# EAGLE design Power Distribution Board (EAGLE 7.7.0)

## Sheet 1 of 6: Main
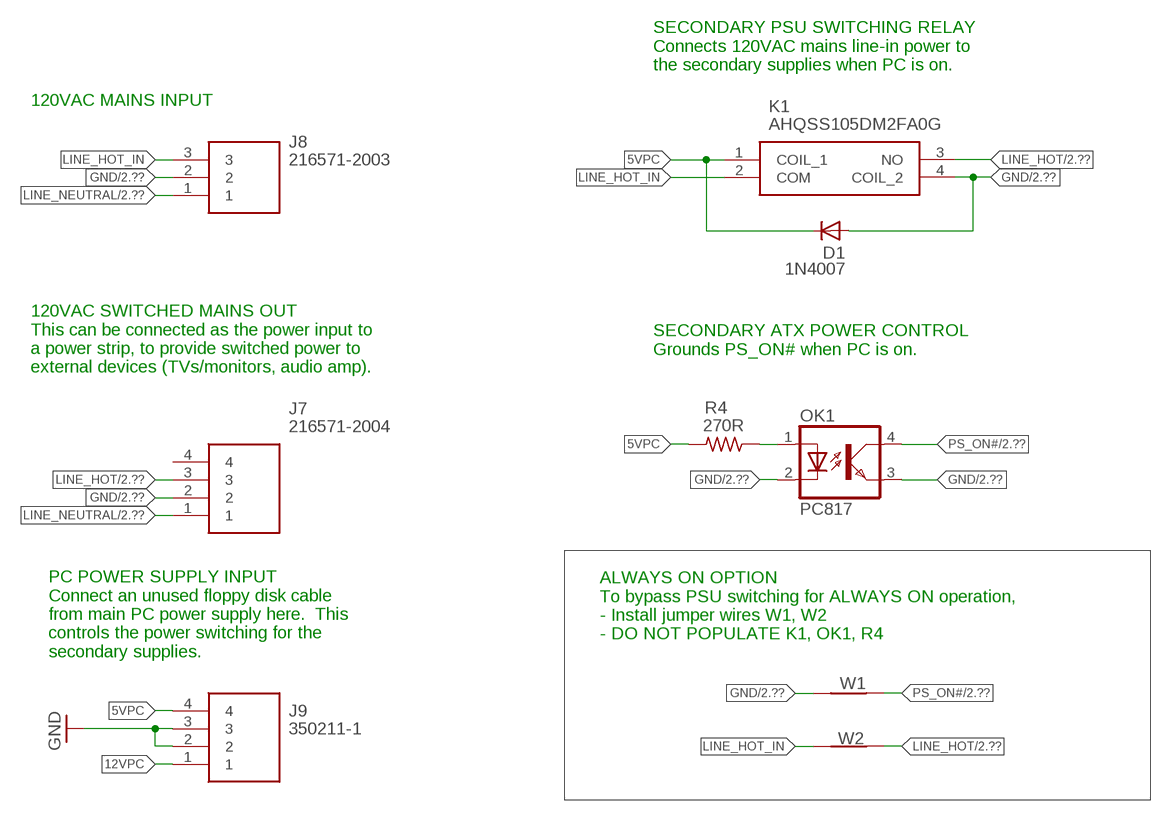
[diagram p0: schematic, sheet 1]

### Parts
D1  1N4007  [DO41-10]
J7  216571-2004  [216571-YY04_1]
J8  216571-2003  [216571-YY03_1]
J9  350211-1  [3502111]
K1  AHQSS105DM2FA0G  [AHQSS105DM2FA0G]
OK1  PC817  [DIL04]
R4  270R  R-US_0204/7  [0204/7]
W1  JUMPER-WIRE  [JUMPER-WIRE]
W2  JUMPER-WIRE  [JUMPER-WIRE]

### Nets
5VPC: D1.C J9.4 K1.1(COIL_1) R4.2
12VPC: J9.1
GND: D1.A J7.2 J8.2 J9.2 J9.3 K1.4(COIL_2) OK1.2(C) OK1.3(EMIT) W1.P$1 ; also sheet 2,3,4,5,6
LINE_HOT: J7.3 K1.3(NO) W2.P$2 ; also sheet 2,3,4
LINE_HOT_IN: J8.3 K1.2(COM) W2.P$1
LINE_NEUTRAL: J7.1 J8.1 ; also sheet 2,3,4
N$4: OK1.1(A) R4.1
PS_ON#: OK1.4(COL) W1.P$2 ; also sheet 2
Unconnected: J7.4

### Notes on the sheet
- SECONDARY PSU SWITCHING RELAY
  Connects 120VAC mains line-in power to
  the secondary supplies when PC is on.
- 120VAC MAINS INPUT
- SECONDARY ATX POWER CONTROL
  Grounds PS_ON# when PC is on.
- 120VAC SWITCHED MAINS OUT
  This can be connected as the power input to
  a power strip, to provide switched power to
  external devices (TVs/monitors, audio amp).
- ALWAYS ON OPTION
  To bypass PSU switching for ALWAYS ON operation,
  - Install jumper wires W1, W2
  - DO NOT POPULATE K1, OK1, R4
- PC POWER SUPPLY INPUT
  Connect an unused floppy disk cable
  from main PC power supply here.  This
  controls the power switching for the
  secondary supplies.

## Sheet 2 of 6: 5/12V SMPS/ATX
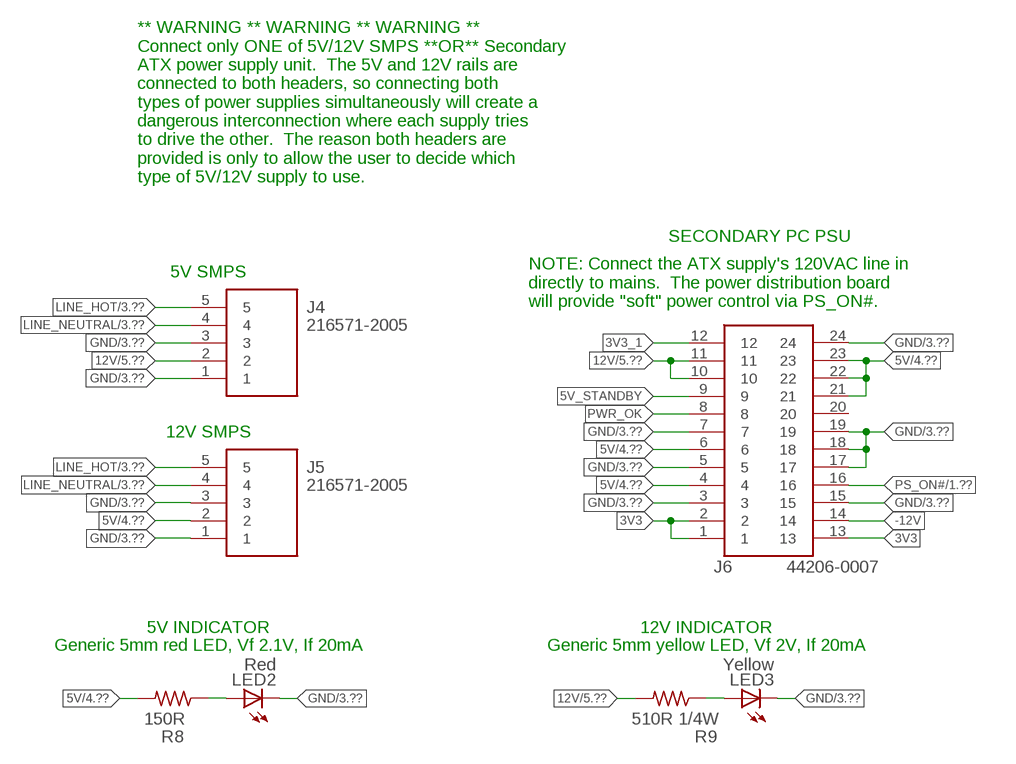
[diagram p1: schematic, sheet 2]

### Parts
J4  216571-2005  [216571-YY05_1]
J5  216571-2005  [216571-YY05_1]
J6  44206-0007  [44206-0007_1]
LED2  Red  LED5MM  [LED5MM]
LED3  Yellow  LED5MM  [LED5MM]
R8  150R  R-US_0309/12  [0309/12]
R9  510R 1/4W  R-US_0309/12  [0309/12]

### Nets
3V3: J6.1 J6.2 J6.13
3V3_1: J6.12
5V: J5.2 J6.4 J6.6 J6.21 J6.22 J6.23 R8.2 ; also sheet 4,5
5V_STANDBY: J6.9
12V: J4.2 J6.10 J6.11 R9.2 ; also sheet 5,6
-12V: J6.14
GND: J4.1 J4.3 J5.1 J5.3 J6.3 J6.5 J6.7 J6.15 J6.17 J6.18 J6.19 J6.24 LED2.K(C) LED3.K(C) ; also sheet 1,3,4,5,6
LINE_HOT: J4.5 J5.5 ; also sheet 1,3,4
LINE_NEUTRAL: J4.4 J5.4 ; also sheet 1,3,4
N$9: LED2.A R8.1
N$10: LED3.A R9.1
PS_ON#: J6.16 ; also sheet 1
PWR_OK: J6.8
Unconnected: J6.20

### Notes on the sheet
- ** WARNING ** WARNING ** WARNING **
  Connect only ONE of 5V/12V SMPS **OR** Secondary
  ATX power supply unit.  The 5V and 12V rails are
  connected to both headers, so connecting both
  types of power supplies simultaneously will create a
  dangerous interconnection where each supply tries
  to drive the other.  The reason both headers are
  provided is only to allow the user to decide which
  type of 5V/12V supply to use.
- SECONDARY PC PSU
- 5V SMPS
- NOTE: Connect the ATX supply's 120VAC line in
  directly to mains.  The power distribution board
  will provide "soft" power control via PS_ON#.
- 12V SMPS
- 5V INDICATOR | 12V INDICATOR
- Generic 5mm red LED, Vf 2.1V, If 20mA | Generic 5mm yellow LED, Vf 2V, If 20mA

## Sheet 3 of 6: 24V SMPS
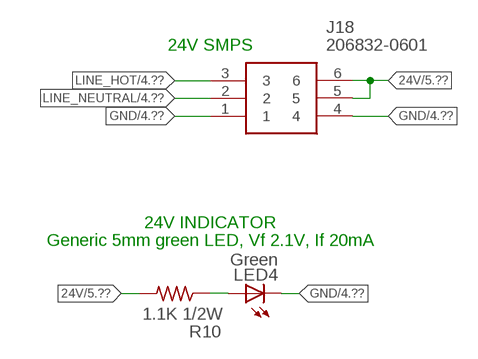
[diagram p2: schematic, sheet 3]

### Parts
J18  206832-0601  [2068320601]
LED4  Green  LED5MM  [LED5MM]
R10  1.1K 1/2W  R-US_0309/12  [0309/12]

### Nets
24V: J18.5 J18.6 R10.2 ; also sheet 5
GND: J18.1 J18.4 LED4.K(C) ; also sheet 1,2,4,5,6
LINE_HOT: J18.3 ; also sheet 1,2,4
LINE_NEUTRAL: J18.2 ; also sheet 1,2,4
N$11: LED4.A R10.1

### Notes on the sheet
- 24V SMPS
- 24V INDICATOR
- Generic 5mm green LED, Vf 2.1V, If 20mA

## Sheet 4 of 6: 48V SMPS
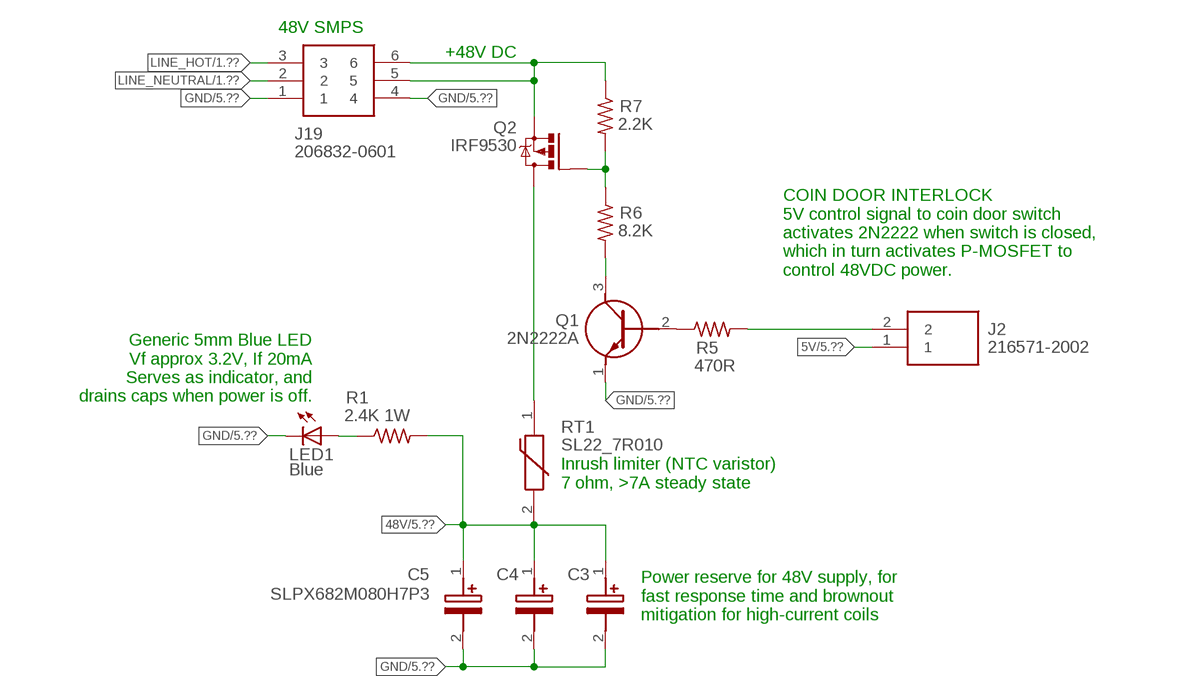
[diagram p3: schematic, sheet 4]

### Parts
C3  SLPX682M080H7P3  [CAPPRD1000W100D3550H4200]
C4  SLPX682M080H7P3  [CAPPRD1000W100D3550H4200]
C5  SLPX682M080H7P3  [CAPPRD1000W100D3550H4200]
J2  216571-2002  [216571-YY02_1]
J19  206832-0601  [2068320601]
LED1  Blue  LED5MM  [LED5MM]
Q1  2N2222A  [2N2222A]
Q2  IRF9530  [TO220BV]
R1  2.4K 1W  R-US_0309/12  [0309/12]
R5  470R  R-US_0204/7  [0204/7]
R6  8.2K  R-US_0207/10  [0207/10]
R7  2.2K  R-US_0207/10  [0207/10]
RT1  SL22_7R010  [SL227R010]

### Nets
5V: J2.1 ; also sheet 2,5
48V: C3.1(+) C4.1(+) C5.1(+) R1.2 RT1.2 ; also sheet 5
GND: C3.2(-) C4.2(-) C5.2(-) J19.1 J19.4 LED1.K(C) Q1.1(E) ; also sheet 1,2,3,5,6
LINE_HOT: J19.3 ; also sheet 1,2,3
LINE_NEUTRAL: J19.2 ; also sheet 1,2,3
N$1: J19.5 J19.6 Q2.S R7.1
N$2: Q2.D RT1.1
N$3: LED1.A R1.1
N$5: Q2.G R6.1 R7.2
N$6: Q1.3(C) R6.2
N$7: Q1.2(B) R5.1
N$8: J2.2 R5.2

### Notes on the sheet
- 48V SMPS
- +48V DC
- COIN DOOR INTERLOCK
  5V control signal to coin door switch
  activates 2N2222 when switch is closed,
  which in turn activates P-MOSFET to
  control 48VDC power.
- Generic 5mm Blue LED
  Vf approx 3.2V, If 20mA
  Serves as indicator, and
  drains caps when power is off.
- Inrush limiter (NTC varistor)
  7 ohm, >7A steady state
- Power reserve for 48V supply, for
  fast response time and brownout
  mitigation for high-current coils

## Sheet 5 of 6: Outputs
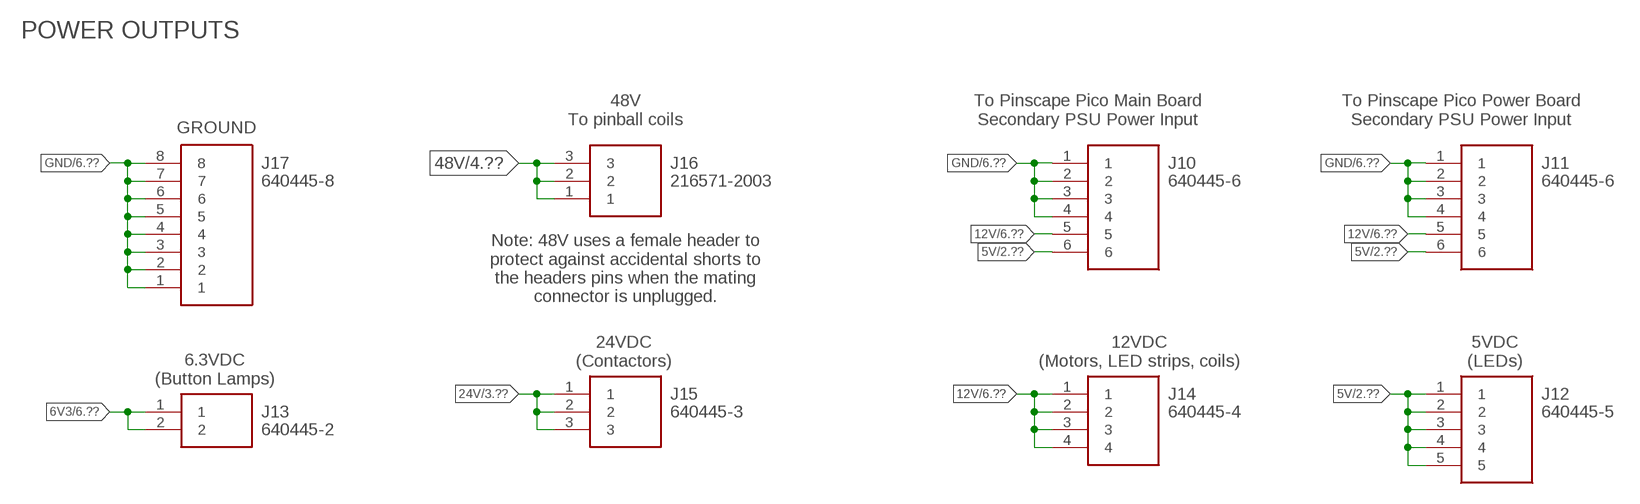
[diagram p4: schematic, sheet 5]

### Parts
J10  640445-6  [SHDR6W183P0X396_1X6_2377X762X1]
J11  640445-6  [SHDR6W183P0X396_1X6_2377X762X1]
J12  640445-5  [HDRV5W117P0X396_1X5_1981X762X1]
J13  640445-2  [SHDR2W117P0X396_1X2_792X762X11]
J14  640445-4  [SHDR4W117P0X396_1X4_1585X762X1]
J15  640445-3  [HDRV3W140P0X396_1X3_1189X762X1]
J16  216571-2003  [216571-YY03_1]
J17  640445-8  [SHDR8W117P0X396_1X8_3170X762X1]

### Nets
5V: J10.6 J11.6 J12.1 J12.2 J12.3 J12.4 J12.5 ; also sheet 2,4
6V3: J13.1 J13.2 ; also sheet 6
12V: J10.5 J11.5 J14.1 J14.2 J14.3 J14.4 ; also sheet 2,6
24V: J15.1 J15.2 J15.3 ; also sheet 3
48V: J16.1 J16.2 J16.3 ; also sheet 4
GND: J10.1 J10.2 J10.3 J10.4 J11.1 J11.2 J11.3 J11.4 J17.1 J17.2 J17.3 J17.4 J17.5 J17.6 J17.7 J17.8 ; also sheet 1,2,3,4,6

### Notes on the sheet
- POWER OUTPUTS
- 48V
  To pinball coils
- To Pinscape Pico Main Board
  Secondary PSU Power Input
- To Pinscape Pico Power Board
  Secondary PSU Power Input
- GROUND
- Note: 48V uses a female header to
  protect against accidental shorts to
  the headers pins when the mating
  connector is unplugged.
- 24VDC
  (Contactors)
- 12VDC
  (Motors, LED strips, coils)
- 5VDC
  (LEDs)
- 6.3VDC
  (Button Lamps)

## Sheet 6 of 6: 6.3V Lamp Power
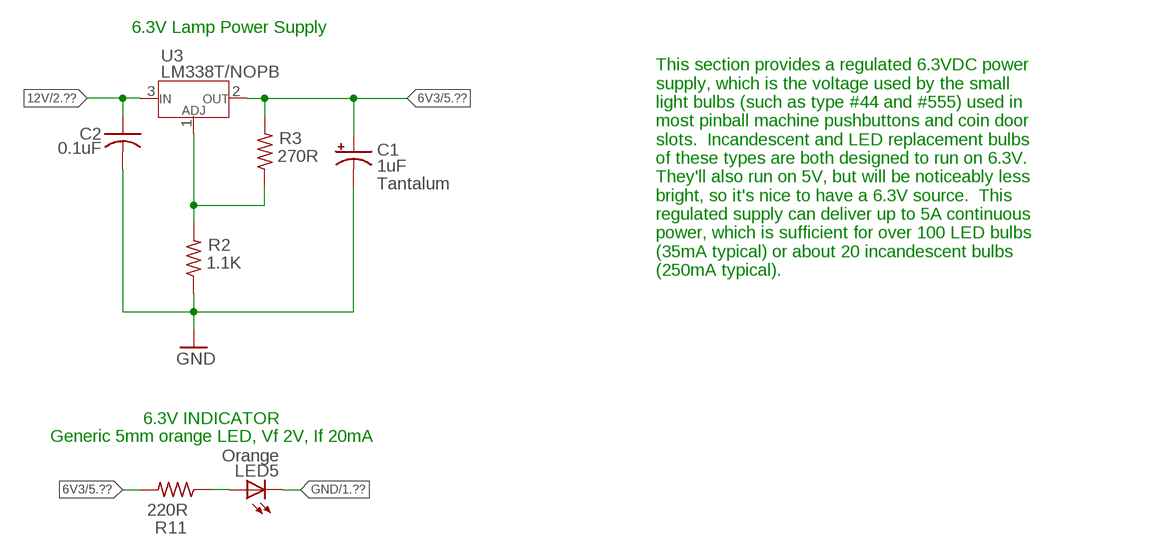
[diagram p5: schematic, sheet 6]

### Parts
C1  1uF  CPOL-US_TANTALUMB45181B  [B45181B]
C2  0.1uF  C-US025-030X050  [C025-030X050]
LED5  Orange  LED5MM  [LED5MM]
R2  1.1K  R-US_0204/7  [0204/7]
R3  270R  R-US_0204/7  [0204/7]
R11  220R  R-US_0309/12  [0309/12]
U3  LM338T/NOPB  [T03B_TEX]

### Nets
6V3: C1.+ R3.2 R11.2 U3.2(OUT) ; also sheet 5
12V: C2.1 U3.3(IN) ; also sheet 2,5
GND: C1.- C2.2 LED5.K(C) R2.1 ; also sheet 1,2,3,4,5
N$12: LED5.A R11.1
N$32: R2.2 R3.1 U3.1(ADJ)

### Notes on the sheet
- 6.3V Lamp Power Supply
- Tantalum
- This section provides a regulated 6.3VDC power
  supply, which is the voltage used by the small
  light bulbs (such as type #44 and #555) used in
  most pinball machine pushbuttons and coin door
  slots.  Incandescent and LED replacement bulbs
  of these types are both designed to run on 6.3V.
  They'll also run on 5V, but will be noticeably less
  bright, so it's nice to have a 6.3V source.  This
  regulated supply can deliver up to 5A continuous
  power, which is sufficient for over 100 LED bulbs
  (35mA typical) or about 20 incandescent bulbs
  (250mA typical).
- 6.3V INDICATOR
- Generic 5mm orange LED, Vf 2V, If 20mA

## Library data of the parts
C1 = rcl:CPOL-US_TANTALUM: POLARIZED CAPACITOR, TANTALUM, American symbol; TYPE: Tantalum
C2 = rcl:C-US: CAPACITOR, American symbol
C3-C5 = SamacSys_Parts:SLPX682M080H7P3: Aluminum Electrolytic Capacitors - Snap In 6800uF 80V 20% 85C Source: Datasheet <http://www.cde.com/resources/catalogs/SLPX.pdf>; DESCRIPTION: Aluminum Electrolytic Capacitors - Snap In 6800uF 80V 20% 85C; HEIGHT: 42mm; MANUFACTURER_NAME: Cornell Dubilier; MANUFACTURER_PART_NUMBER: SLPX682M080H7P3; MOUSER_PART_NUMBER: 598-SLPX682M080H7P3; MOUSER_PRICE-STOCK: https://www.mouser.co.uk/ProductDetail/Cornell-Dubilier-CDE/SLPX682M080H7P3?qs=tRzVlScAa5o35yBUJPuoEg%3D%3D
D1 = diode:1N4007: DIODE general purpose rectifier, 1 A
J2 = SamacSys_Parts:216571-2002: Micro-Fit+ Vertical Header, 3.00mm Pitch, Single Row, 2 Circuits, UL 94V-0, Glow-Wire Capable, Black Source: Datasheet <https://www.molex.com/pdm_docs/sd/2165711002_sd.pdf>; DESCRIPTION: Micro-Fit+ Vertical Header, 3.00mm Pitch, Single Row, 2 Circuits, UL 94V-0, Glow-Wire Capable, Black; HEIGHT: 9.91mm; MANUFACTURER_NAME: Molex; MANUFACTURER_PART_NUMBER: 216571-2002; MOUSER_PART_NUMBER: 538-216571-2002; MOUSER_PRICE-STOCK: https://www.mouser.co.uk/ProductDetail/Molex/216571-2002?qs=aP1CjGhiNiG6dHzAhm9BPA%3D%3D
J4 J5 = SamacSys_Parts:216571-2005: Micro-Fit+ Vertical Header, 3.00mm Pitch, Single Row, 5 Circuits, UL 94V-0, Glow-Wire Capable, Black Source: Datasheet <https://www.molex.com/pdm_docs/sd/2165711002_sd.pdf>; DESCRIPTION: Micro-Fit+ Vertical Header, 3.00mm Pitch, Single Row, 5 Circuits, UL 94V-0, Glow-Wire Capable, Black; HEIGHT: 9.91mm; MANUFACTURER_NAME: Molex; MANUFACTURER_PART_NUMBER: 216571-2005; MOUSER_PART_NUMBER: 538-216571-2005; MOUSER_PRICE-STOCK: https://www.mouser.co.uk/ProductDetail/Molex/216571-2005?qs=pBJMDPsKWf2lJPZ1Kn1Y%2FQ%3D%3D
J6 = SamacSys_Parts:44206-0007: Mini-Fit Jr. Header, Dual Row, Vertical, with 11.90mm Locking Ramp, 24 Circuits, with Peg 2 Snap-in Plastic Peg Source: Datasheet <https://www.molex.com/pdm_docs/sd/442060001_sd.pdf>; DESCRIPTION: Mini-Fit Jr. Header, Dual Row, Vertical, with 11.90mm Locking Ramp, 24 Circuits, with Peg 2 Snap-in Plastic Peg; HEIGHT: 12.8mm; MANUFACTURER_NAME: Molex; MANUFACTURER_PART_NUMBER: 44206-0007; MOUSER_PART_NUMBER: 538-44206-0007; MOUSER_PRICE-STOCK: https://www.mouser.co.uk/ProductDetail/Molex/44206-0007?qs=g5f4E6w8l8gzEjxCgQ0R8g%3D%3D
J7 = SamacSys_Parts:216571-2004: Micro-Fit+ Vertical Header, 3.00mm Pitch, Single Row, 4 Circuits, UL 94V-0, Glow-Wire Capable, Black Source: Datasheet <https://www.molex.com/pdm_docs/sd/2165711002_sd.pdf>; DESCRIPTION: Micro-Fit+ Vertical Header, 3.00mm Pitch, Single Row, 4 Circuits, UL 94V-0, Glow-Wire Capable, Black; HEIGHT: 9.91mm; MANUFACTURER_NAME: Molex; MANUFACTURER_PART_NUMBER: 216571-2004; MOUSER_PART_NUMBER: 538-216571-2004; MOUSER_PRICE-STOCK: https://www.mouser.co.uk/ProductDetail/Molex/216571-2004?qs=aP1CjGhiNiF7n7A0oSUBZQ%3D%3D
J8 J16 = SamacSys_Parts:216571-2003: Micro-Fit+ Vertical Header, 3.00mm Pitch, Single Row, 3 Circuits, UL 94V-0, Glow-Wire Capable, Black Source: Datasheet <https://www.molex.com/pdm_docs/sd/2165711002_sd.pdf>; DESCRIPTION: Micro-Fit+ Vertical Header, 3.00mm Pitch, Single Row, 3 Circuits, UL 94V-0, Glow-Wire Capable, Black; HEIGHT: 9.91mm; MANUFACTURER_NAME: Molex; MANUFACTURER_PART_NUMBER: 216571-2003; MOUSER_PART_NUMBER: 538-216571-2003; MOUSER_PRICE-STOCK: https://www.mouser.co.uk/ProductDetail/Molex/216571-2003?qs=aP1CjGhiNiEG0f3ovv4spA%3D%3D
J9 = SamacSys_Parts:350211-1: Pin & Socket Connectors CONN PCM 4 POS TIN Source: Datasheet; DESCRIPTION: Pin & Socket Connectors CONN PCM 4 POS TIN; HEIGHT: 10.29mm; MANUFACTURER_NAME: TE Connectivity; MANUFACTURER_PART_NUMBER: 350211-1; MOUSER_PART_NUMBER: 571-3502111; MOUSER_PRICE-STOCK: https://www.mouser.co.uk/ProductDetail/TE-Connectivity-AMP/350211-1?qs=wtYpWE7xRjkLa2TSgKGgng%3D%3D
J10 J11 = SamacSys_Parts:640445-6: 6 way friction lock header,3.96mm pitch Source: Datasheet <https://componentsearchengine.com/Datasheets/1/640445-6.pdf>; DESCRIPTION: 6 way friction lock header,3.96mm pitch; HEIGHT: 11.049mm; MANUFACTURER_NAME: TE Connectivity; MANUFACTURER_PART_NUMBER: 640445-6; MOUSER_PART_NUMBER: 571-6404456; MOUSER_PRICE-STOCK: https://www.mouser.com/Search/Refine.aspx?Keyword=571-6404456
J12 = SamacSys_Parts:640445-5: Headers & Wire Housings FRCTN LK HDR STR 5P Square post tin Source: Datasheet <https://www.te.com/commerce/DocumentDelivery/DDEController?Action=showdoc&DocId=Customer Drawing640445AD5pdfEnglishENG_CD_640445_AD5.pdf640445-5>; DESCRIPTION: Headers & Wire Housings FRCTN LK HDR STR 5P Square post tin; HEIGHT: 13.716mm; MANUFACTURER_NAME: TE Connectivity; MANUFACTURER_PART_NUMBER: 640445-5; MOUSER_PART_NUMBER: 571-640445-5; MOUSER_PRICE-STOCK: https://www.mouser.co.uk/ProductDetail/TE-Connectivity/640445-5?qs=P8zzrVhehateG3JS5ZzrEg%3D%3D
J13 = SamacSys_Parts:640445-2: 2 way friction lock header,3.96mm pitch TE Connectivity MTA-156 Series, 3.96mm Pitch 2 Way 1 Row Straight PCB Header, Through Hole, Solder Termination Source: Datasheet <https://componentsearchengine.com/Datasheets/2/640445-2.pdf>; DESCRIPTION: 2 way friction lock header,3.96mm pitch TE Connectivity MTA-156 Series, 3.96mm Pitch 2 Way 1 Row Straight PCB Header, Through Hole, Solder Termination; HEIGHT: 11.049mm; MANUFACTURER_NAME: TE Connectivity; MANUFACTURER_PART_NUMBER: 640445-2; MOUSER_PART_NUMBER: 5716404452; MOUSER_PRICE-STOCK: https://www.mouser.co.uk/ProductDetail/TE-Connectivity-AMP/640445-2?qs=P8zzrVhehau7EdfErby3cQ%3D%3D
J14 = SamacSys_Parts:640445-4: Conn Wire to Board HDR 4 POS 3.96mm Solder ST Top Entry Thru-Hole Package Source: Datasheet <https://www.te.com/commerce/DocumentDelivery/DDEController?Action=showdoc&DocId=Customer Drawing640445AD5pdfEnglishENG_CD_640445_AD5.pdf640445-4>; DESCRIPTION: Conn Wire to Board HDR 4 POS 3.96mm Solder ST Top Entry Thru-Hole Package; HEIGHT: 13.716mm; MANUFACTURER_NAME: TE Connectivity; MANUFACTURER_PART_NUMBER: 640445-4; MOUSER_PART_NUMBER: 571-6404454; MOUSER_PRICE-STOCK: https://www.mouser.co.uk/ProductDetail/TE-Connectivity-AMP/640445-4?qs=P8zzrVhehatZnQ7HMsIjxw%3D%3D
J15 = SamacSys_Parts:640445-3: Headers & Wire Housings FRCTN LK HDR STR 3P Square post tin Source: Datasheet <http://www.te.com/commerce/DocumentDelivery/DDEController?Action=showdoc&DocId=Customer Drawing640445AD1pdfEnglishENG_CD_640445_AD1.pdf>; DESCRIPTION: Headers & Wire Housings FRCTN LK HDR STR 3P Square post tin; HEIGHT: 16.891mm; MANUFACTURER_NAME: TE Connectivity; MANUFACTURER_PART_NUMBER: 640445-3; MOUSER_PART_NUMBER: 571-6404453; MOUSER_PRICE-STOCK: https://www.mouser.co.uk/ProductDetail/TE-Connectivity-AMP/640445-3?qs=P8zzrVhehatqNJOmpqYOfA%3D%3D
J17 = SamacSys_Parts:640445-8: 8 way friction lock header,3.96mm pitch Source: Datasheet <http://www.te.com/commerce/DocumentDelivery/DDEController?Action=srchrtrv&DocNm=640445&DocType=Customer Drawing&DocLang=English>; DESCRIPTION: 8 way friction lock header,3.96mm pitch; HEIGHT: 13.716mm; MANUFACTURER_NAME: TE Connectivity; MANUFACTURER_PART_NUMBER: 640445-8; MOUSER_PART_NUMBER: 571-6404458; MOUSER_PRICE-STOCK: https://www.mouser.co.uk/ProductDetail/TE-Connectivity-AMP/640445-8?qs=P8zzrVhehats63GzZ3ijGg%3D%3D
J18 J19 = SamacSys_Parts:206832-0601: Headers & Wire Housings Micro-Fit Plus Vert HDR ASSY 2X3 Tin Lu Source: Datasheet <https://componentsearchengine.com/Datasheets/1/206832-0601.pdf>; DESCRIPTION: Headers & Wire Housings Micro-Fit Plus Vert HDR ASSY 2X3 Tin Lu; HEIGHT: 10.99mm; MANUFACTURER_NAME: Molex; MANUFACTURER_PART_NUMBER: 206832-0601; MOUSER_PART_NUMBER: 538-206832-0601; MOUSER_PRICE-STOCK: https://www.mouser.co.uk/ProductDetail/Molex/206832-0601?qs=EBDBlbfErPyv6tUvq0oX3w%3D%3D
K1 = SamacSys_Parts:AHQSS105DM2FA0G: General Purpose Relays Commercial RelayRated Carrying Current :16AType of Sealing : Case Sealed TypeNumber of pole : one poleCoil Voltage : 5VCoil Type : Standard DC CoilContact Form : Form A Coil Insulation System : F- Class F (155C) Source: Datasheet; DESCRIPTION: General Purpose Relays Commercial RelayRated Carrying Current :16AType of Sealing : Case Sealed TypeNumber of pole : one poleCoil Voltage : 5VCoil Type : Standard DC CoilContact Form : Form A Coil Insulation System : F- Class F (155C); HEIGHT: 15.3mm; MANUFACTURER_NAME: Amphenol; MANUFACTURER_PART_NUMBER: AHQSS105DM2FA0G; MOUSER_PART_NUMBER: 523-AHQSS105DM2FA0G; MOUSER_PRICE-STOCK: https://www.mouser.co.uk/ProductDetail/Amphenol-Anytek/AHQSS105DM2FA0G?qs=vvQtp7zwQdMcHeqcpOr95g%3D%3D
LED1-LED5 = led:LED: LED OSRAM: - CHIPLED LG R971, LG N971, LY N971, LG Q971, LY Q971, LO R971, LY R971 LH N974, LH R974 LS Q976, LO Q976, LY Q976 LO Q996 - Hyper CHIPLED LW Q18S LB Q993, LB Q99A, LB R99A - SideLED LS A670, LO A670, LY A670, LG A670, LP A670 LB A673, LV A673, LT A673, LW A673 LH A674 LY A675 LS A676, LA A676, LO A676, LY A676, LW A676 LS A679, LY A679, LG A679 - Hyper Micro SIDELED® LS Y876, LA Y876, LO Y876, LY Y876 LT Y87S - SmartLED LW L88C, LW L88S LB L89C, LB L89S, LG L890 LS L89K, LO L89K, LY L89K LS L896, LA L896, LO L896, LY L896 - TOPLED LS T670, LO T670, LY T670, LG T670, LP T670 LSG T670, LSP T670, LSY T670, LOP T670, LYG T670 LG T671, LOG T671, LSG T671 LB T673, LV T673, LT T673, LW T673 LH T674 LS T676, LA T676, LO T676, LY T676, LB T676, LH T676, LSB T676, LW T676 LB T67C, LV T67C, LT T67C, LS T67K, LO T67K, LY T67K, LW E67C LS E67B, LA E67B, LO E67B, LY E67B, LB E67C, LV E67C, LT E67C LW T67C LS T679, LY T679, LG T679 LS T770, LO T770, LY T770, LG T770, LP T770 LB T773, LV T773, LT T773, LW T773 LH T774 LS E675, LA E675, LY E675, LS T675 LS T776, LA T776, LO T776, LY T776, LB T776 LHGB T686 LT T68C, LB T68C - Hyper Mini TOPLED® LB M676 - Mini TOPLED Santana® LG M470 LS M47K, LO M47K, LY M47K Source: http://www.osram.convergy.de LUXEON: - LUMILED® LXK2-PW12-R00, LXK2-PW12-S00, LXK2-PW14-U00, LXK2-PW14-V00 LXK2-PM12-R00, LXK2-PM12-S00, LXK2-PM14-U00 LXK2-PE12-Q00, LXK2-PE12-R00, LXK2-PE12-S00, LXK2-PE14-T00, LXK2-PE14-U00 LXK2-PB12-K00, LXK2-PB12-L00, LXK2-PB12-M00, LXK2-PB14-N00, LXK2-PB14-P00, LXK2-PB14-Q00 LXK2-PR12-L00, LXK2-PR12-M00, LXK2-PR14-Q00, LXK2-PR14-R00 LXK2-PD12-Q00, LXK2-PD12-R00, LXK2-PD12-S00 LXK2-PH12-R00, LXK2-PH12-S00 LXK2-PL12-P00, LXK2-PL12-Q00, LXK2-PL12-R00 Source: www.luxeon.com KINGBRIGHT: KA-3528ASYC Source: www.kingbright.com
OK1 = optocoupler:PC817: SHARP OPTO COUPLER; MPN: PC817X4J000F; OC_FARNELL: 9707727; OC_NEWARK: 97K7059
Q1 = SamacSys_Parts:2N2222A: NPN General purpose transistor . IC 150 mA . f 100 MHz Source: Datasheet <https://diotec.com/request/datasheet/2n2222a.pdf>; DESCRIPTION: NPN General purpose transistor . IC 150 mA . f 100 MHz; HEIGHT: 7.5mm; MANUFACTURER_NAME: Diotec; MANUFACTURER_PART_NUMBER: 2N2222A; MOUSER_PART_NUMBER: 637-2N2222A; MOUSER_PRICE-STOCK: https://www.mouser.co.uk/ProductDetail/Diotec-Semiconductor/2N2222A?qs=OlC7AqGiEDmNlRSTGL2dYg%3D%3D
Q2 = transistor-power:IRF9530: P-CHANNEL HEXFET POWER-MOS-FET Source: http://www.irf.com/product-info/datasheets/data/irf9530.pdf
R1-R11 = rcl:R-US_: RESISTOR, American symbol
RT1 = SamacSys_Parts:SL22_7R010: Inrush Current Limiters 22mm 7ohms 10A INRSH CURR LIMITER Source: Datasheet; DESCRIPTION: Inrush Current Limiters 22mm 7ohms 10A INRSH CURR LIMITER; HEIGHT: 21mm; MANUFACTURER_NAME: AMETHERM; MANUFACTURER_PART_NUMBER: SL22 7R010; MOUSER_PART_NUMBER: 995-SL22-7R010; MOUSER_PRICE-STOCK: https://www.mouser.co.uk/ProductDetail/Ametherm/SL22-7R010?qs=PVyXUKBeRH2ZMsD3aeRuwg%3D%3D
U3 = LM338:LM338T/NOPB; COPYRIGHT: Copyright (C) 2023 Ultra Librarian. All rights reserved.; MANUFACTURER_PART_NUMBER: LM338T/NOPB; MFR_NAME: Texas Instruments
W1 W2 = SamacSys_Parts:JUMPER-WIRE

## Board
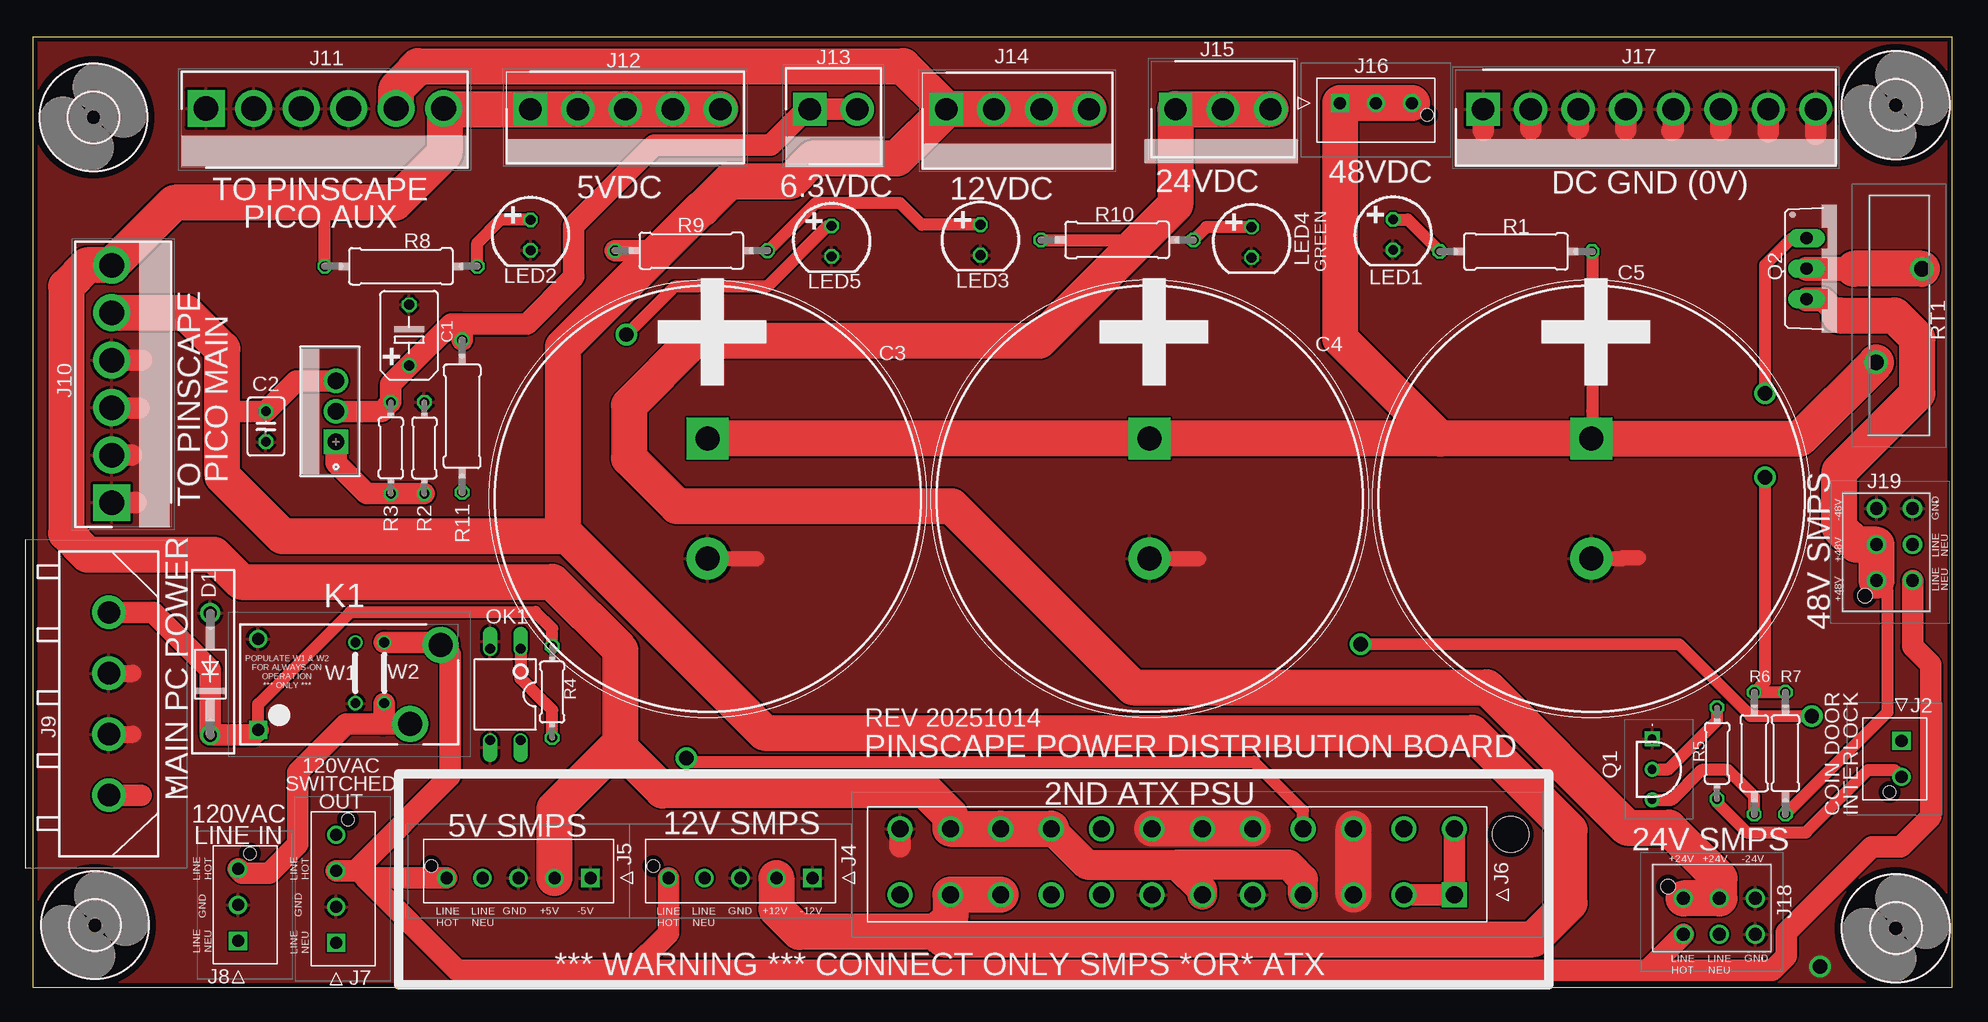
[diagram p6: board, top side]
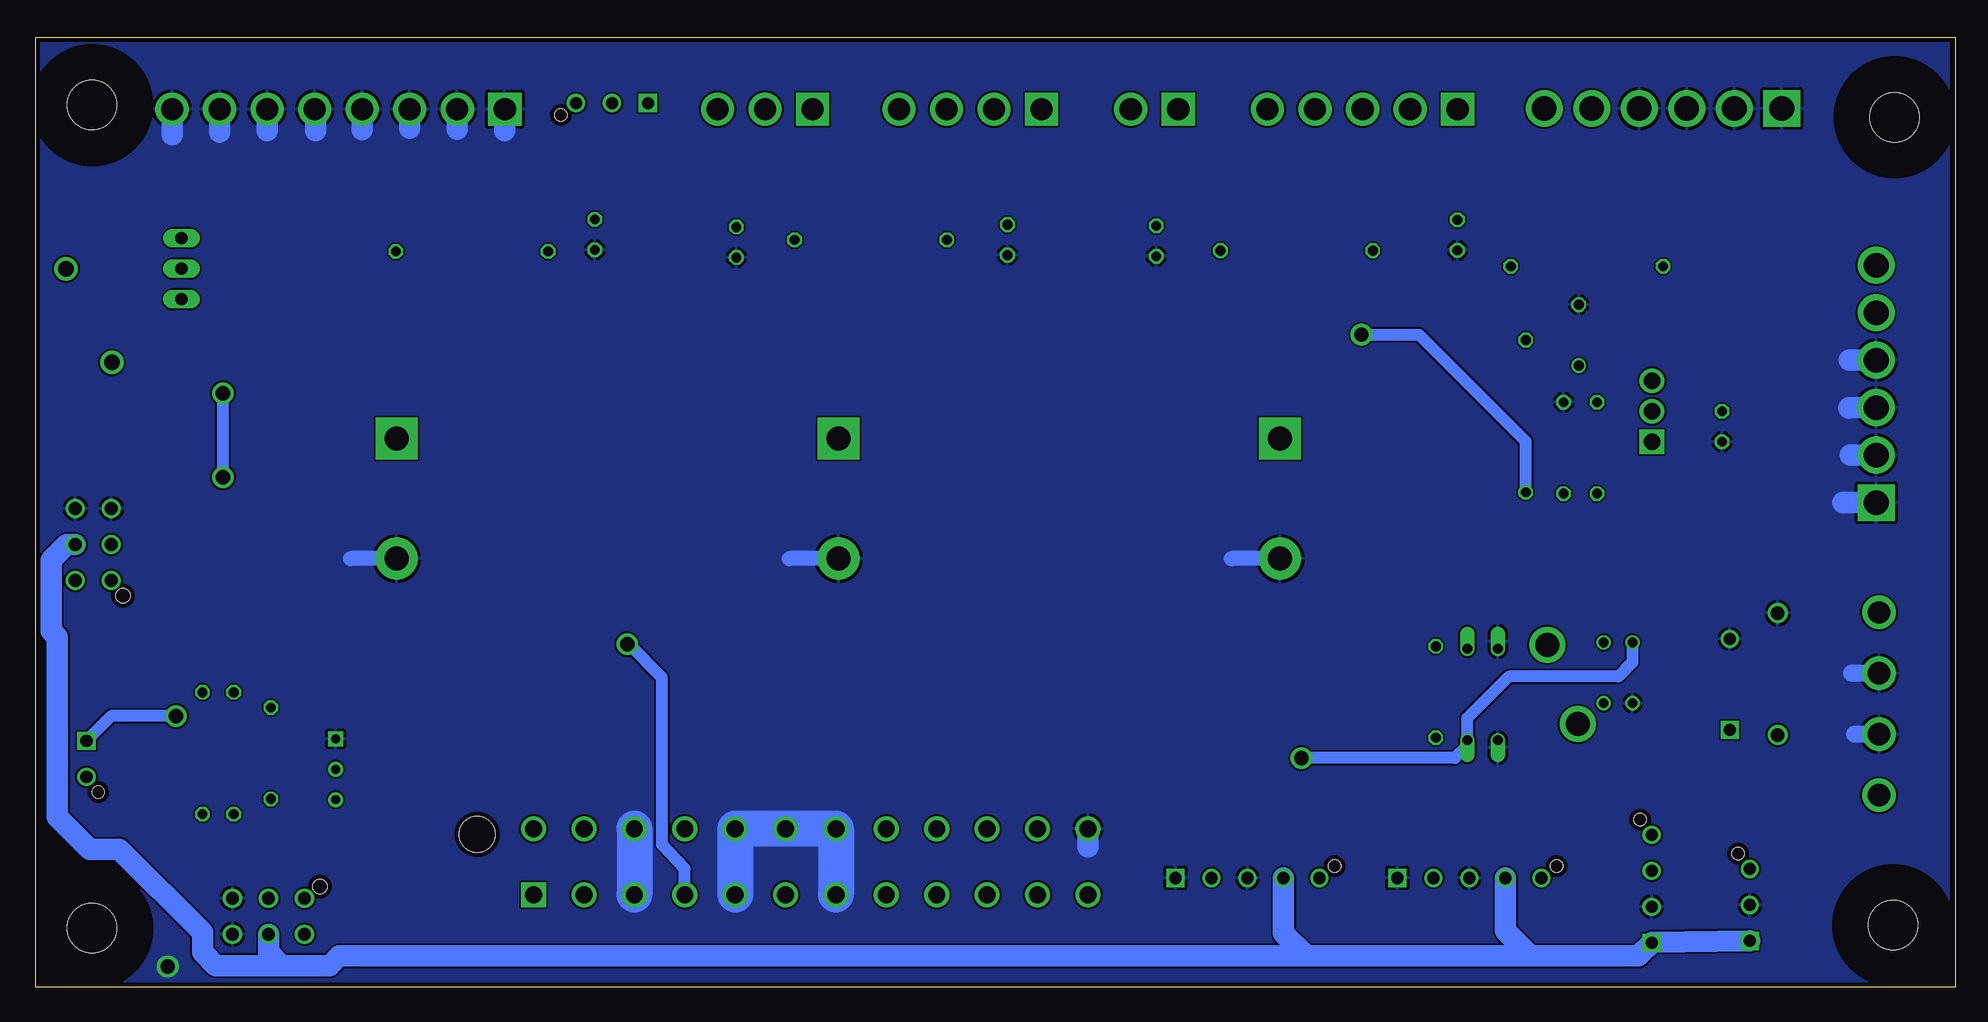
[diagram p7: board, bottom side, seen from below]

Size 160 x 79.2 mm. Coordinates in mm from the lower left corner, seen from the top.
Outline: 0,0 160,0 160,79.2 0,79.2 0,0
Copper layers (1*16): Top 0.035559375mm / dielectric 1.6mm / Bottom 0.035559375mm
Design rules "oshpark-2layer": minimum track width 6mil, minimum drill 10mil, track to track 6mil, track to pad 6mil, pad to pad 6mil, via to via 6mil, smd to smd 6mil, copper to edge 15mil, drill to drill 6mil, minimum pad ring 5mil, minimum via ring 5mil, stop-mask expansion 2.5mil, vias tented up to drill 0mil, thermal gap 10mil

### Footprints (pad centres in the part's own frame; a part is rotated, then mirrored left to right if it is on the bottom)
B45181B = drill 0.813: + -2.54,0 | drill 0.813 octagon: - 2.54,0
C025-030X050 = drill 0.813 octagon: 1 -1.27,0; 2 1.27,0
CAPPRD1000W100D3550H4200 = drill 2 pad 3.5 square: 1 0,0 | drill 2 pad 3.5: 2 10,0
DO41-10 = drill 1.118: A 5.08,0; C -5.08,0
216571-YY02_1 = drill 1.02 pad 1.52 square: 1 0,0 | drill 1.02 pad 1.52: 2 -3,0 | hole 1.02: -4.28,0.98
216571-YY05_1 = drill 1.02 pad 1.52 square: 1 0,0 | drill 1.02 pad 1.52: 2 -3,0; 3 -6,0; 4 -9,0; 5 -12,0 | hole 1.02: -13.28,0.98
44206-0007_1 = drill 1.4 pad 1.9 square: 1 0,0 | drill 1.4 pad 1.9: 2 -4.2,0; 3 -8.4,0; 4 -12.6,0; 5 -16.8,0; 6 -21,0; 7 -25.2,0; 8 -29.4,0; 9 -33.6,0; 10 -37.8,0; 11 -42,0; 12 -46.2,0; 13 0,5.5; 14 -4.2,5.5; 15 -8.4,5.5; 16 -12.6,5.5; 17 -16.8,5.5; 18 -21,5.5; 19 -25.2,5.5; 20 -29.4,5.5; 21 -33.6,5.5; 22 -37.8,5.5; 23 -42,5.5; 24 -46.2,5.5 | hole 3: 4.7,5.04
216571-YY04_1 = drill 1.02 pad 1.52 square: 1 0,0 | drill 1.02 pad 1.52: 2 -3,0; 3 -6,0; 4 -9,0 | hole 1.02: -10.28,0.98
216571-YY03_1 = drill 1.02 pad 1.52 square: 1 0,0 | drill 1.02 pad 1.52: 2 -3,0; 3 -6,0 | hole 1.02: -7.28,0.98
3502111 = drill 1.86 pad 2.79: 1 0,0; 2 -5.08,0; 3 -10.16,0; 4 -15.24,0
SHDR6W183P0X396_1X6_2377X762X1 = drill 2.05 pad 3.075 square: 1 0,0 | drill 2.05 pad 3.075: 2 3.96,0; 3 7.92,0; 4 11.88,0; 5 15.84,0; 6 19.8,0
HDRV5W117P0X396_1X5_1981X762X1 = drill 1.85 pad 2.775 square: 1 7.92,0 | drill 1.85 pad 2.775: 2 3.958,0; 3 -0.004,0; 4 -3.966,0; 5 -7.928,0
SHDR2W117P0X396_1X2_792X762X11 = drill 1.85 pad 2.775 square: 1 0,0 | drill 1.85 pad 2.775: 2 3.962,0
SHDR4W117P0X396_1X4_1585X762X1 = drill 1.85 pad 2.775 square: 1 5.94,0 | drill 1.85 pad 2.775: 2 1.978,0; 3 -1.984,0; 4 -5.946,0
HDRV3W140P0X396_1X3_1189X762X1 = drill 1.85 pad 2.775 square: 1 0,0 | drill 1.85 pad 2.775: 2 3.962,0; 3 7.924,0
SHDR8W117P0X396_1X8_3170X762X1 = drill 1.85 pad 2.775 square: 1 0,0 | drill 1.85 pad 2.775: 2 -3.962,0; 3 -7.924,0; 4 -11.886,0; 5 -15.848,0; 6 -19.81,0; 7 -23.772,0; 8 -27.734,0
2068320601 = drill 1.07 pad 1.605: 1 0,0; 2 -3,0; 3 -6,0; 4 0,3; 5 -3,3; 6 -6,3 | hole 1.2: -7.28,3.98
AHQSS105DM2FA0G = drill 1 pad 1.5 square: 1 0,0 | drill 2 pad 3: 2 12.7,0.5; 3 15.24,7.1 | drill 1 pad 1.5: 4 0,7.6
LED5MM = drill 0.813 octagon: A -1.27,0; K 1.27,0
DIL04 = drill 0.813 offset: 1 -1.27,-3.81; 2 1.27,-3.81; 3 1.27,3.81; 4 -1.27,3.81
2N2222A = drill 0.72 pad 1.234 square: 1 0,0 | drill 0.72 pad 1.234: 2 2.54,0; 3 5.08,0
TO220BV = drill 1.016 long: D 0,-2.54; G -2.54,-2.54; S 2.54,-2.54
0309/12 = drill 0.813 octagon: 1 -6.35,0; 2 6.35,0
0204/7 = drill 0.813 octagon: 1 -3.81,0; 2 3.81,0
0207/10 = drill 0.813 octagon: 1 -5.08,0; 2 5.08,0
SL227R010 = drill 1.3 pad 1.95: 1 0,0; 2 7.8,-3.82
T03B_TEX = drill 1.372 pad 1.88 square: 1 0,0 | drill 1.372 pad 1.88: 2 2.54,0; 3 5.08,0
4,1 = hole 4.1: 0,0
JUMPER-WIRE = drill 0.8: P$1 -2.54,0; P$2 2.54,0

### Placement (x,y rotation side)
C1  31.38,54.36 90 top
C2  19.44,46.74 270 top
C3  56.27,45.72 270 top
C4  93.1,45.72 270 top
C5  129.93,45.72 270 top
D1  14.8,26.1 90 top
J2  155.77,20.53 90 top
J4  65,9.1 0 top
J5  46.5,9.1 0 top
J6  118.5,7.7 0 top
J7  25.3,3.7 270 top
J8  17.13,3.85 270 top
J9  6.35,16 270 top
J10  6.59,40.39 90 top
J11  14.46,73.26 0 top
J12  49.4,73.2 180 top
J13  64.77,73.2 0 top
J14  82.1,73.2 180 top
J15  95.25,73.2 0 top
J16  108.97,73.7 180 top
J17  120.9,73.2 180 top
J18  143.6,4.4 0 top
J19  156.7,39.9 90 top
K1  18.78,21.44 0 top
LED1  113.4,62.74 270 top
LED2  41.5,62.7 270 top
LED3  79,62.3 270 top
LED4  101.6,62.1 270 top
LED5  66.6,62.2 270 top
OK1  39.4,24.4 180 top
Q1  135,20.7 270 top
Q2  150.4,59.9 270 top
R1  123.64,61.33 0 top
R2  32.65,44.96 270 top
R3  29.86,44.96 90 top
R4  43.3,24.6 90 top
R5  140.4,19.5 270 top
R6  143.5,19.5 270 top
R7  146.1,19.5 90 top
R8  30.7,60.1 180 top
R9  54.9,61.4 180 top
R10  90.4,62.3 180 top
R11  35.8,47.6 90 top
RT1  157.48,59.88 270 top
U3  25.29,45.47 90 top
U$1  [4,1]  155.3,73.53 0 top
U$2  [4,1]  5.19,5.16 0 top
U$3  [4,1]  5.06,72.52 0 top
U$4  [4,1]  155.3,4.91 0 top
W1  26.9,26.2 90 top
W2  29.3,26.2 90 top

### Tracks (layer width: path | path; a pad name or v marks a point on that pad's centre or on a via)
3V3
  Top 1.778: J6.13 J6.1 J6.2
5V  (via drill 1.2)
  Top 1: R8.2 24.35,64.95 23.9,65.4 | v148.3,22.6 143.2,22.6 137.2,28.6 v110.7,28.6
  Top 2.5: J6.21 87.9,10.2 95.4,10.2 | J6.6 97.5,8.1 95.4,10.2 | 95.4,10.2 104.7,10.2 105.9,9 J6.4
  Top 3: J6.21 J6.22 J6.23 76.5,14.3 74.4,16.4 52.5,16.4 48.75,20.15 | 34.32,73.2 J11.6 | 34.32,73.2 34.32,69.52 30.2,65.4 23.9,65.4 11.8,65.4 J10.6 4.54,60.19 2.78,58.42 2.78,37.85 4.56,36.07 15.1,36.07 17.39,33.78 43.32,33.78 49,28.1 49,20.4 48.75,20.15 | J5.2 43.5,14.9 48.75,20.15 | 34.32,73.2 J12.1 J12.2 J12.3 J12.4 J12.5
  Bottom 1: v148.3,22.6 153.7,22.6 J2.1 | J6.4 105.9,9.9 107.8,11.9 107.8,25.8 110.6,28.6 v110.7,28.6
5VPC
  Top 1: R4.2 43.3,29.9 41.9,31.3 26.5,31.3 18.78,23.58 K1.1
  Top 1.778: J9.4 10.06,31.24 14.8,26.5 D1.C 18.36,21.02 K1.1
6V3
  Top 1.778: J13.2 J13.1 64.5,73.2 61.5,70.2 51.8,70.2 45.1,63.5 45.1,59.2 41.2,55.3 35.6,55.3 | U3.2 29.1,48.01 R3.2 29.86,50.29 C1.+ 34.87,55.3 35.6,55.3 | R11.2 35.8,55.1 35.6,55.3
12V
  Top 1.27: 25.41,50.67 U3.3
  Top 1.778: U3.3 21.98,50.55 C2.1 15.89,48.01 15.8,48.1 | R9.2 51.9,61.4 52.05,61.25
  Top 3: J10.5 12.77,56.23 15.8,53.2 15.8,48.1 15.8,42.6 20.8,37.6 44.2,37.6 | J6.10 J6.11 76.5,5.8 75.3,4.6 | 44.2,37.6 44.6,37.6 61,21.2 120,21.2 128.1,13.1 128.1,7 125.1,4 75.9,4 75.3,4.6 | J11.5 30.3,74.9 31.8,76.4 31.8,76.5 32.1,76.8 72.56,76.8 J14.1 | 75.3,4.6 63.9,4.6 62,6.5 J4.2 | J14.4 J14.3 J14.2 J14.1 | J14.1 72.06,69.1 65.1,69.1 63.2,67.2 58.1,67.2 55.8,64.9 55.7,64.9 52.05,61.25 46.05,55.25 45.7,54.9 44.2,53.4 44.2,37.6
12VPC
  Top 1.778: J9.1 9.05,16
24V
  Top 1: R10.2 91.9,62.3 92.11,62.09
  Top 3: J15.3 J15.2 J15.1 95.25,65.23 92.11,62.09 83.92,53.9 55.1,53.9 49.7,48.5 49.7,44.1 53.7,40.1 76.6,40.1 91.7,25 121.2,25 132.9,13.3 136.4,13.3 140.6,9.1 J18.5 J18.6
48V
  Top 1: R1.2 129.99,48.07 C5.1
  Top 3: J16.3 J16.2 J16.1 108.97,54.05 117.3,45.72 | 117.3,45.72 C5.1 147.3,45.72 RT1.2 | 117.3,45.72 C4.1 C3.1
GND  (via drill 1.2)
  Top 1.27: C3.2 60.36,35.72 | C4.2 97.19,35.72 | C5.2 132.49,35.72 132.59,35.81 133.86,35.81
  Top 1.397: J9.3 8.38,26.16 | J9.2 8.38,21.08
  Top 1.778: J17.1 120.9,71.42 | J17.2 124.87,71.52 | J17.3 128.83,71.62 | J17.4 132.79,71.47 | J17.5 136.75,71.52 136.65,71.42 | J17.6 140.71,71.42 | J17.7 144.68,71.27 | J10.4 9.07,52.27 | J10.3 6.59,48.26 8.87,48.26 | J10.2 8.26,44.35 | J10.1 8.62,40.39 | J17.8 148.64,71.09 | J6.24 72.3,11.7
  Top 3: J6.3 J6.15 | J6.18 J6.19 | J6.17 97.6,13.2
  Bottom 1.27: C3.2 60.36,35.72 | C4.2 97.19,35.72 | C5.2 133.76,35.72
  Bottom 1.397: J9.3 8.64,26.16 | J9.2 8.38,21.08
  Bottom 1.778: J17.2 124.87,71.52 | J17.3 128.83,71.62 | J17.4 132.79,71.47 | J17.5 136.65,73.2 136.65,71.42 | J17.6 140.71,71.42 | J17.7 144.68,71.27 | J17.1 120.9,71.42 | J10.4 8.82,52.27 | J10.3 8.83,48.31 8.87,48.26 | J10.2 8.77,44.35 | J10.1 9.38,40.39 | J17.8 148.64,71.09 | J6.24 72.3,11.7
  Bottom 3: J6.7 J6.19 J6.17 J6.5 | J6.15 J6.3
  other vias: 149,1.7
  pour Top: 0.25,79.77 160.27,79.77 160.27,0 0.25,0
  pour Bottom: 0.51,80.02 160.27,80.02 160.27,-0.25 0.51,-0.25
LINE_HOT
  Top 1.778: 134.6,1.4 49.9,1.4 | 49.9,1.4 35.4,1.4 27.7,9.1 | J7.3 26.9,9.7 27,9.8 | W2.P$2 33.82,28.74 K1.3 34.06,28.54 34.8,27.8 34.8,17.6 27,9.8 | 27.7,9.1 27,9.8 | J5.5 27.7,9.1 | J4.5 53,4.5 49.9,1.4 | J19.3 156.7,28.4 158.2,26.9 158.2,14.2 155.7,11.7 153.3,11.7 146.17,4.57 146.17,2.57 145,1.4 134.6,1.4 | 134.6,1.4 J18.3
LINE_HOT_IN
  Top 1.778: K1.2 29.2,21.94 | J8.3 17.48,9.5 19.7,9.5 22.1,11.9 22.1,17.9 26.14,21.94 29.2,21.94 | W2.P$1 29.3,22.04 29.2,21.94
LINE_NEUTRAL
  Bottom 1.778: J8.1 25.25,3.75 J7.1 26.4,2.6 35.4,2.6 | 54.1,2.6 134.7,2.6 135.5,1.8 139.5,1.8 | 54.1,2.6 35.4,2.6 | J4.4 56,4.5 54.1,2.6 | J5.4 37.5,4.7 35.4,2.6 | J19.2 157.4,36.9 158.7,35.6 158.7,29.7 158.2,29.2 158.2,14.2 155.5,11.5 153.03,11.5 146.1,4.57 146.1,2.9 145,1.8 139.5,1.8 | 139.5,1.8 140.6,2.9 J18.2
N$1
  Top 1: R7.1 154.6,22.92 154.6,33 J19.6
  Top 2: Q2.S 149.24,57.36 150.6,56
  Top 3: 150.6,56 155.2,56 157.1,54.1 157.1,49.5 150.6,43 150.6,38.3 152,36.9 J19.5 J19.6
N$2
  Top 2: Q2.D 151.8,59.9
  Top 3: RT1.1 151.82,59.88 151.8,59.9
N$3
  Top 1: LED1.A 114.62,64.01 R1.1
N$4
  Top 1: OK1.1 40.67,25.73 42.4,24 42.8,23.6 43.3,23.1 R4.1
N$5  (via drill 1.2)
  Top 1: R7.2 R6.1 144.4,25.48 v144.4,42.5 | Q2.G 146.64,62.44 144.4,60.2 v144.4,49.5
  Bottom 1: v144.4,49.5 v144.4,42.5
N$6
  Top 1: Q1.3 136.62,15.62 139.1,18.1 141.3,18.1 143.5,15.9 R6.2
N$7
  Top 1: Q1.2 136.36,18.16 140.4,22.2 R5.1
N$8
  Top 1: J2.2 155.2,18.1 153,18.1 147.8,12.9 142.9,12.9 140.4,15.4 R5.2
N$9
  Top 1: LED2.A 38.97,63.97 37.05,62.05 R8.1
N$10
  Top 1: LED3.A 74.1,63.57 72.27,65.4 65.3,65.4 61.3,61.4 R9.1
N$11
  Top 1: LED4.A 97.82,63.37 R10.1
N$12  (via drill 1.2)
  Top 1: LED5.A 66.27,63.47 61.2,58.4 53.5,58.4 v49.5,54.4
  Bottom 1: v49.5,54.4 44.7,54.4 35.8,45.5 R11.1
N$32
  Top 1.778: R2.2 R3.1 27.83,41.15 25.29,43.69 U3.1
PS_ON#  (via drill 1.2)
  Top 1: J6.16 105.9,14.7 101.8,18.8 54.8,18.8 v54.5,19.1
  Bottom 1: W1.P$2 26.9,27.1 28.1,25.9 37.2,25.9 40.67,22.43 OK1.4 40.67,20.13 41.7,19.1 v54.5,19.1

### Text on the board
tPlace: POPULATE W1 & W2 / FOR ALWAYS-ON / OPERATION / *** ONLY ***
tNames: 48VDC | 5VDC | 6.3VDC | 12VDC | 24VDC | DC GND (0V) | TO PINSCAPE / PICO AUX | GREEN | TO PINSCAPE / PICO MAIN | -48V | GND | LINE / NEU | 48V SMPS | +48V | LINE / NEU | +48V | MAIN PC POWER | REV 20251014 | PINSCAPE POWER DISTRIBUTION BOARD | COIN DOOR / INTERLOCK | 120VAC / SWITCHED / OUT | 2ND ATX PSU | 120VAC / LINE IN | 5V SMPS | 12V SMPS | 24V SMPS | +24V | +24V | -24V | LINE / HOT | LINE / HOT | GND | GND | LINE / HOT | LINE / NEU | GND | +5V | -5V | LINE / HOT | LINE / NEU | GND | +12V | -12V | LINE / NEU | LINE / NEU | *** WARNING *** CONNECT ONLY SMPS *OR* ATX | LINE / HOT | LINE / NEU | GND